# Altium schematic sheet УШЯИ.411618.029Э Э3 Лист 5.schdoc
size 420 x 297 mm; SheetNumber: 4; SheetTotal: 7
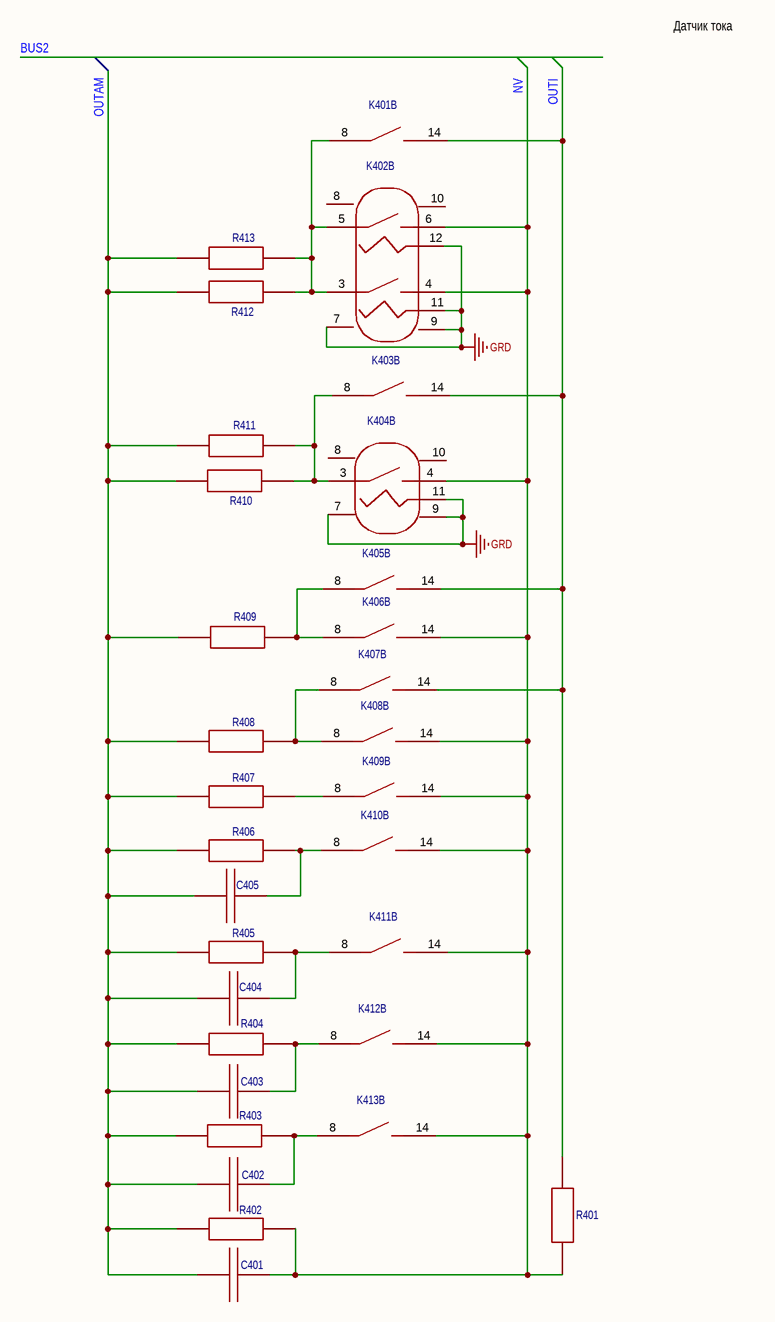
[diagram p0: УШЯИ.411618.029Э Э3 Лист 5.schdoc]

## Parts
C401  Конденсатор К10-17Б М47 33пФ NP0 5% [DIP]  [Конденсатор К10-17Б М47 X.X.xФ  NP0 5% [DIP 8мм]]  (value not drawn)
C402  Конденсатор К10-17Б М47 33пФ NP0 5% [DIP]  [Конденсатор К10-17Б М47 X.X.xФ  NP0 5% [DIP 5мм]]  (value not drawn)
C403  Конденсатор К10-17Б М47 33пФ NP0 5% [DIP]  [Конденсатор К10-17Б М47 X.X.xФ  NP0 5% [DIP 5мм]]  (value not drawn)
C404  Конденсатор К10-17Б М47 33пФ NP0 5% [DIP]  [Конденсатор К10-17Б М47 X.X.xФ  NP0 5% [DIP 5мм]]  (value not drawn)
C405  Конденсатор К10-17Б М47 33пФ NP0 5% [DIP]  [Конденсатор К10-17Б М47 X.X.xФ  NP0 5% [DIP 5мм]]  (value not drawn)
K401  Реле герконовое DIP05-1A72-13L  [PCB]  [RELAY-TH_STANDEXMEDER_DIP05-1A72-13L]  (value not drawn)  (part B of 2)
K402  Реле герконовое УШЯИ.685442.092 (2 реле)  (value not drawn)  (part B of 2)
K403  Реле герконовое DIP05-1A72-13L  [PCB]  [RELAY-TH_STANDEXMEDER_DIP05-1A72-13L]  (value not drawn)  (part B of 2)
K404  Реле герконовое УШЯИ.685442.092 (1 реле)  (value not drawn)  (part B of 2)
K405  Реле герконовое DIP05-1A72-13L  [PCB]  [RELAY-TH_STANDEXMEDER_DIP05-1A72-13L]  (value not drawn)  (part B of 2)
K406  Реле герконовое DIP05-1A72-13L  [PCB]  [RELAY-TH_STANDEXMEDER_DIP05-1A72-13L]  (value not drawn)  (part B of 2)
K407  Реле герконовое DIP05-1A72-13L  [PCB]  [RELAY-TH_STANDEXMEDER_DIP05-1A72-13L]  (value not drawn)  (part B of 2)
K408  Реле герконовое DIP05-1A72-13L  [PCB]  [RELAY-TH_STANDEXMEDER_DIP05-1A72-13L]  (value not drawn)  (part B of 2)
K409  Реле герконовое DIP05-1A72-13L  [PCB]  [RELAY-TH_STANDEXMEDER_DIP05-1A72-13L]  (value not drawn)  (part B of 2)
K410  Реле герконовое DIP05-1A72-13L  [PCB]  [RELAY-TH_STANDEXMEDER_DIP05-1A72-13L]  (value not drawn)  (part B of 2)
K411  Реле герконовое DIP05-1A72-13L  [PCB]  [RELAY-TH_STANDEXMEDER_DIP05-1A72-13L]  (value not drawn)  (part B of 2)
K412  Реле герконовое DIP05-1A72-13L  [PCB]  [RELAY-TH_STANDEXMEDER_DIP05-1A72-13L]  (value not drawn)  (part B of 2)
K413  Реле герконовое DIP05-1A72-13L  [PCB]  [RELAY-TH_STANDEXMEDER_DIP05-1A72-13L]  (value not drawn)  (part B of 2)
R401  Резистор C2-29В-0,25  24кОм ±0,5% [DIP]  (value not drawn)
R402  Резистор SM204031006FE 100МОм ±1%[DIP]  [RES-TH_L27.4-W2.5-P22.86-D0.8]  (value not drawn)
R403  Резистор RK1/4DCT52R1105F 11 МОм ±1% [DIP]  (value not drawn)
R404  Резистор C2-29В-0,25 1 МОм ±0,5% [DIP]  (value not drawn)
R405  Резистор C2-29В-0,25 100 кОм ±0,5% [DIP]  (value not drawn)
R406  Резистор C2-29B-1 10 кОм ±0,5% [DIP]  (value not drawn)
R407  Резистор C2-29B-1 1 кОм ±0,5% [DIP]  (value not drawn)
R408  Резистор C2-29B-1 100 Ом ±0,5% [DIP]  (value not drawn)
R409  Резистор C2-29B-2 10 Ом ±0,5% [DIP]  (value not drawn)
R410  Резистор MP930-2.00-1% [TO-220-2]  [TO-220-2_L10.4-W3.2-P5.08-L]  (value not drawn)
R411  Резистор MP930-2.00-1% [TO-220-2]  [TO-220-2_L10.4-W3.2-P5.08-L]  (value not drawn)
R412  Резистор MP930-0.20-1% [TO-220-2]  [TO-220-2_L10.4-W3.2-P5.08-L]  (value not drawn)
R413  Резистор MP930-0.20-1% [TO-220-2]  [TO-220-2_L10.4-W3.2-P5.08-L]  (value not drawn)

## Nets
GRD: K402.7 K402.9 K402.11 K402.12 K404.7 K404.9 K404.11
NV: C401.1 K402.4 K402.6 K404.4 K406.14 K408.14 K409.14 K410.14 K411.14 K412.14 K413.14 R401.1 R402.1
OUTAM: C401.2 C402.2 C403.2 C404.2 C405.2 R402.2 R403.2 R404.2 R405.2 R406.2 R407.2 R408.2 R409.2 R410.2 R411.2 R412.2 R413.2
OUTI: K401.14 K403.14 K405.14 K407.14 R401.2
NetC402_1: C402.1 K413.8 R403.1
NetC403_1: C403.1 K412.8 R404.1
NetC404_1: C404.1 K411.8 R405.1
NetC405_1: C405.1 K410.8 R406.1
NetK401_8: K401.8 K402.3 K402.5 R412.1 R413.1
NetK403_8: K403.8 K404.3 R410.1 R411.1
NetK405_8: K405.8 K406.8 R409.1
NetK407_8: K407.8 K408.8 R408.1
NetK409_8: K409.8 R407.1

Not connected (* = marked no-connect by the designer): K402 8 10; K404 8 10

## Buses and harness runs
bus BUS2

## Notes on the sheet
- Датчик тока
- Подп. и дата
- Инв.№ дубл.
- Взам.инв.№
- Подп.и дата
- Инв.№ подл.
- Изм.
- Лист
- № докум.
- Подп.
- Дата
- Формат  A3

## Library data of the parts
C401 = Конденсатор К10-17Б М47 33пФ NP0 5% [DIP]: Contributor: jordanjin; Convert to PCB: yes; UniqueId: ggeb2980edeb3a9b297; Origin Footprint: К10-17Б М47; Device: Конденсатор К10-17Б М47 33пФ NP0 5% [DIP]; Symbol: Конденсатор К10-17Б М47 33пФ NP0 5% [DIP]; Manufacturer Part: К10-17Б М47; Add into BOM: yes; spicePre: C; spiceSymbolName: Конденсатор К10-17Б М47 33пФ NP0 5% [DIP]
C402 = Конденсатор К10-17Б М47 33пФ NP0 5% [DIP]: Contributor: jordanjin; Convert to PCB: yes; UniqueId: gge1afb12a00f1bc7d3; Origin Footprint: К10-17Б М47; Device: Конденсатор К10-17Б М47 33пФ NP0 5% [DIP]; Symbol: Конденсатор К10-17Б М47 33пФ NP0 5% [DIP]; Manufacturer Part: К10-17Б М47; Add into BOM: yes; spicePre: C; spiceSymbolName: Конденсатор К10-17Б М47 33пФ NP0 5% [DIP]
C403 = Конденсатор К10-17Б М47 33пФ NP0 5% [DIP]: Contributor: jordanjin; Convert to PCB: yes; UniqueId: gge58857190431db6b6; Origin Footprint: К10-17Б М47; Device: Конденсатор К10-17Б М47 33пФ NP0 5% [DIP]; Symbol: Конденсатор К10-17Б М47 33пФ NP0 5% [DIP]; Manufacturer Part: К10-17Б М47; Add into BOM: yes; spicePre: C; spiceSymbolName: Конденсатор К10-17Б М47 33пФ NP0 5% [DIP]
C404 C405 = Конденсатор К10-17Б М47 33пФ NP0 5% [DIP]: Contributor: jordanjin; Convert to PCB: yes; UniqueId: gge5cad80b88e7cf07d; Origin Footprint: К10-17Б М47; Device: Конденсатор К10-17Б М47 33пФ NP0 5% [DIP]; Symbol: Конденсатор К10-17Б М47 33пФ NP0 5% [DIP]; Manufacturer Part: К10-17Б М47; Add into BOM: yes; spicePre: C; spiceSymbolName: Конденсатор К10-17Б М47 33пФ NP0 5% [DIP]
K401 = Реле герконовое DIP05-1A72-13L  [PCB]: Manufacturer: STANDEXMEDER; subpart_no: 1; Contributor: jordanjin; Convert to PCB: yes; UniqueId: gge7703f0eace438da9; Origin Footprint: RELAY-TH_STANDEXMEDER_DIP05-1A72-13L; Device: Реле герконовое DIP05-1A72-13L  [PCB]; Symbol: Реле герконовое DIP05-1A72-13L  [PCB]; Supplier: LCSC; Supplier Part: C1524853; Manufacturer Part: DIP05-1A72-13L; JLCPCB Part Class: Extended Part; spicePre: K; spiceSymbolName: Реле герконовое DIP05-1A72-13L  [PCB]; Add into BOM: yes; FootprintName: RELAY-TH_STANDEXMEDER_DIP05-1A72-13L
K402 = Реле герконовое УШЯИ.685442.092 (2 реле): Manufacturer: ОАО"МНИПИ"; Part Number: 1; Origin Footprint: УШЯИ.685442.092 В2; Contributor: jordanjin; Convert to PCB: yes; UniqueId: gge1247e5c314fd5f25; Device: Реле герконовое УШЯИ.685442.092 (2 реле); Symbol: Реле герконовое УШЯИ.685442.092 (2 реле); Supplier: LCSC; Manufacturer Part: УШЯИ.685442.092; Subpart_no: 1; Add into BOM: yes; spicePre: K; spiceSymbolName: Реле герконовое УШЯИ.685442.092 (2 реле)
K403 = Реле герконовое DIP05-1A72-13L  [PCB]: Manufacturer: STANDEXMEDER; subpart_no: 1; Contributor: jordanjin; Convert to PCB: yes; UniqueId: ggecfce9d1afd95e29a; Origin Footprint: RELAY-TH_STANDEXMEDER_DIP05-1A72-13L; Device: Реле герконовое DIP05-1A72-13L  [PCB]; Symbol: Реле герконовое DIP05-1A72-13L  [PCB]; Supplier: LCSC; Supplier Part: C1524853; Manufacturer Part: DIP05-1A72-13L; JLCPCB Part Class: Extended Part; spicePre: K; spiceSymbolName: Реле герконовое DIP05-1A72-13L  [PCB]; Add into BOM: yes; FootprintName: RELAY-TH_STANDEXMEDER_DIP05-1A72-13L
K404 = Реле герконовое УШЯИ.685442.092 (1 реле): Manufacturer: ОАО"МНИПИ"; subpart_no: 1; Contributor: jordanjin; Convert to PCB: yes; UniqueId: gge4bca94a3251bd602; Origin Footprint: УШЯИ.685442.092; Device: Реле герконовое УШЯИ.685442.092 (1 реле); Symbol: Реле герконовое УШЯИ.685442.092 (1 реле); Supplier: LCSC; Manufacturer Part: УШЯИ.685442.092; JLCPCB Part Class: Extended Part; spicePre: K; spiceSymbolName: Реле герконовое УШЯИ.685442.092 (1 реле); Add into BOM: yes
K405 = Реле герконовое DIP05-1A72-13L  [PCB]: Manufacturer: STANDEXMEDER; subpart_no: 1; Contributor: jordanjin; Convert to PCB: yes; UniqueId: gge6582920def2a9cac; Origin Footprint: RELAY-TH_STANDEXMEDER_DIP05-1A72-13L; Device: Реле герконовое DIP05-1A72-13L  [PCB]; Symbol: Реле герконовое DIP05-1A72-13L  [PCB]; Supplier: LCSC; Supplier Part: C1524853; Manufacturer Part: DIP05-1A72-13L; JLCPCB Part Class: Extended Part; spicePre: K; spiceSymbolName: Реле герконовое DIP05-1A72-13L  [PCB]; Add into BOM: yes; FootprintName: RELAY-TH_STANDEXMEDER_DIP05-1A72-13L
K406 = Реле герконовое DIP05-1A72-13L  [PCB]: Manufacturer: STANDEXMEDER; subpart_no: 1; Contributor: jordanjin; Convert to PCB: yes; UniqueId: gge44bfcf777da063ff; Origin Footprint: RELAY-TH_STANDEXMEDER_DIP05-1A72-13L; Device: Реле герконовое DIP05-1A72-13L  [PCB]; Symbol: Реле герконовое DIP05-1A72-13L  [PCB]; Supplier: LCSC; Supplier Part: C1524853; Manufacturer Part: DIP05-1A72-13L; JLCPCB Part Class: Extended Part; spicePre: K; spiceSymbolName: Реле герконовое DIP05-1A72-13L  [PCB]; Add into BOM: yes; FootprintName: RELAY-TH_STANDEXMEDER_DIP05-1A72-13L
K407 = Реле герконовое DIP05-1A72-13L  [PCB]: Manufacturer: STANDEXMEDER; subpart_no: 1; Contributor: jordanjin; Convert to PCB: yes; UniqueId: gge83a96914b1356f5b; Origin Footprint: RELAY-TH_STANDEXMEDER_DIP05-1A72-13L; Device: Реле герконовое DIP05-1A72-13L  [PCB]; Symbol: Реле герконовое DIP05-1A72-13L  [PCB]; Supplier: LCSC; Supplier Part: C1524853; Manufacturer Part: DIP05-1A72-13L; JLCPCB Part Class: Extended Part; spicePre: K; spiceSymbolName: Реле герконовое DIP05-1A72-13L  [PCB]; Add into BOM: yes; FootprintName: RELAY-TH_STANDEXMEDER_DIP05-1A72-13L
K408 = Реле герконовое DIP05-1A72-13L  [PCB]: Manufacturer: STANDEXMEDER; subpart_no: 1; Contributor: jordanjin; Convert to PCB: yes; UniqueId: gge25a55c81e8cc81bc; Origin Footprint: RELAY-TH_STANDEXMEDER_DIP05-1A72-13L; Device: Реле герконовое DIP05-1A72-13L  [PCB]; Symbol: Реле герконовое DIP05-1A72-13L  [PCB]; Supplier: LCSC; Supplier Part: C1524853; Manufacturer Part: DIP05-1A72-13L; JLCPCB Part Class: Extended Part; spicePre: K; spiceSymbolName: Реле герконовое DIP05-1A72-13L  [PCB]; Add into BOM: yes; FootprintName: RELAY-TH_STANDEXMEDER_DIP05-1A72-13L
K409 = Реле герконовое DIP05-1A72-13L  [PCB]: Manufacturer: STANDEXMEDER; subpart_no: 1; Contributor: jordanjin; Convert to PCB: yes; UniqueId: gge6e1296d6b40714de; Origin Footprint: RELAY-TH_STANDEXMEDER_DIP05-1A72-13L; Device: Реле герконовое DIP05-1A72-13L  [PCB]; Symbol: Реле герконовое DIP05-1A72-13L  [PCB]; Supplier: LCSC; Supplier Part: C1524853; Manufacturer Part: DIP05-1A72-13L; JLCPCB Part Class: Extended Part; spicePre: K; spiceSymbolName: Реле герконовое DIP05-1A72-13L  [PCB]; Add into BOM: yes; FootprintName: RELAY-TH_STANDEXMEDER_DIP05-1A72-13L
K410 = Реле герконовое DIP05-1A72-13L  [PCB]: Manufacturer: STANDEXMEDER; subpart_no: 1; Contributor: jordanjin; Convert to PCB: yes; UniqueId: ggece3a82d518531f55; Origin Footprint: RELAY-TH_STANDEXMEDER_DIP05-1A72-13L; Device: Реле герконовое DIP05-1A72-13L  [PCB]; Symbol: Реле герконовое DIP05-1A72-13L  [PCB]; Supplier: LCSC; Supplier Part: C1524853; Manufacturer Part: DIP05-1A72-13L; JLCPCB Part Class: Extended Part; spicePre: K; spiceSymbolName: Реле герконовое DIP05-1A72-13L  [PCB]; Add into BOM: yes; FootprintName: RELAY-TH_STANDEXMEDER_DIP05-1A72-13L
K411 = Реле герконовое DIP05-1A72-13L  [PCB]: Manufacturer: STANDEXMEDER; subpart_no: 1; Contributor: jordanjin; Convert to PCB: yes; UniqueId: gge32df1270bb8c8d2c; Origin Footprint: RELAY-TH_STANDEXMEDER_DIP05-1A72-13L; Device: Реле герконовое DIP05-1A72-13L  [PCB]; Symbol: Реле герконовое DIP05-1A72-13L  [PCB]; Supplier: LCSC; Supplier Part: C1524853; Manufacturer Part: DIP05-1A72-13L; JLCPCB Part Class: Extended Part; spicePre: K; spiceSymbolName: Реле герконовое DIP05-1A72-13L  [PCB]; Add into BOM: yes; FootprintName: RELAY-TH_STANDEXMEDER_DIP05-1A72-13L
K412 = Реле герконовое DIP05-1A72-13L  [PCB]: Manufacturer: STANDEXMEDER; subpart_no: 1; Contributor: jordanjin; Convert to PCB: yes; UniqueId: gge25a4072e4ef30527; Origin Footprint: RELAY-TH_STANDEXMEDER_DIP05-1A72-13L; Device: Реле герконовое DIP05-1A72-13L  [PCB]; Symbol: Реле герконовое DIP05-1A72-13L  [PCB]; Supplier: LCSC; Supplier Part: C1524853; Manufacturer Part: DIP05-1A72-13L; JLCPCB Part Class: Extended Part; spicePre: K; spiceSymbolName: Реле герконовое DIP05-1A72-13L  [PCB]; Add into BOM: yes; FootprintName: RELAY-TH_STANDEXMEDER_DIP05-1A72-13L
K413 = Реле герконовое DIP05-1A72-13L  [PCB]: Manufacturer: STANDEXMEDER; subpart_no: 1; Contributor: jordanjin; Convert to PCB: yes; UniqueId: ggef3d88c0f6f02bbb0; Origin Footprint: RELAY-TH_STANDEXMEDER_DIP05-1A72-13L; Device: Реле герконовое DIP05-1A72-13L  [PCB]; Symbol: Реле герконовое DIP05-1A72-13L  [PCB]; Supplier: LCSC; Supplier Part: C1524853; Manufacturer Part: DIP05-1A72-13L; JLCPCB Part Class: Extended Part; spicePre: K; spiceSymbolName: Реле герконовое DIP05-1A72-13L  [PCB]; Add into BOM: yes; FootprintName: RELAY-TH_STANDEXMEDER_DIP05-1A72-13L
R401 = Резистор C2-29В-0,25  24кОм ±0,5% [DIP]: Contributor: jordanjin; Convert to PCB: yes; UniqueId: gge0309ee4b015114c0; Origin Footprint: C2-29В-0,25; Device: Резистор C2-29В-0,25  24кОм ±0,5% [DIP]; Symbol: Резистор C2-29В-0,25  24кОм ±0,5% [DIP]; Manufacturer Part: C2-29В-0,25; spicePre: R; spiceSymbolName: Резистор C2-29В-0,25 1 МОм ±0,5% [DIP]; Add into BOM: yes
R402 = Резистор SM204031006FE 100МОм ±1%[DIP]: Manufacturer: Ohmite; Contributor: jordanjin; Convert to PCB: yes; UniqueId: gge398e542ec90bf08a; ModelId: 5898483a0a144dd58ae137ef3515169e; Origin Footprint: RES-TH_L27.4-W2.5-P22.86-D0.8; Device: Резистор SM204031006FE 100МОм ±1%[DIP]; Symbol: Резистор SM204031006FE 100МОм ±1%[DIP]; Supplier: LCSC; Manufacturer Part: SM204031006FE; JLCPCB Part Class: Extended Part; spicePre: R; spiceSymbolName: Резистор SM204031006FE 100МОм ±1%[DIP]; Add into BOM: yes; FootprintName: RES-TH_L27.4-W2.5-P22.86-D0.8; ModelName: RES-TH_L27.4-W2.5-P22.86-D0.8
R403 = Резистор RK1/4DCT52R1105F 11 МОм ±1% [DIP]: Manufacturer: KOA Speer Electronics; Contributor: jordanjin; Convert to PCB: yes; UniqueId: gge17af7a16159332f4; Origin Footprint: RK1/4DCT52R1105F; Device: Резистор RK1/4DCT52R1105F 11 МОм ±1% [DIP]; Symbol: Резистор RK1/4DCT52R1105F 11 МОм ±1% [DIP]; Supplier: LCSC; Manufacturer Part: RK1/4DCT52R1105F; JLCPCB Part Class: Extended Part; spicePre: R; spiceSymbolName: Резистор RK1/4DCT52R1105F 11 МОм ±1% [DIP]; Add into BOM: yes
R404 = Резистор C2-29В-0,25 1 МОм ±0,5% [DIP]: Contributor: jordanjin; Convert to PCB: yes; UniqueId: gge597395f2396ee8d0; Origin Footprint: C2-29В-0,25; Device: Резистор C2-29В-0,25 1 МОм ±0,5% [DIP]; Symbol: Резистор C2-29В-0,25 1 МОм ±0,5% [DIP]; Manufacturer Part: C2-29В-0,25; spicePre: R; spiceSymbolName: Резистор C2-29В-0,25 1 МОм ±0,5% [DIP]; Add into BOM: yes
R405 = Резистор C2-29В-0,25 100 кОм ±0,5% [DIP]: Contributor: jordanjin; Convert to PCB: yes; UniqueId: gge822403ea663bc24b; Origin Footprint: C2-29В-0,25; Device: Резистор C2-29В-0,25 100 кОм ±0,5% [DIP]; Symbol: Резистор C2-29В-0,25 100 кОм ±0,5% [DIP]; Manufacturer Part: C2-29В-0,25; spicePre: R; spiceSymbolName: Резистор C2-29В-0,25 1 МОм ±0,5% [DIP]; Add into BOM: yes
R406 = Резистор C2-29B-1 10 кОм ±0,5% [DIP]: Origin Footprint: C2-29В-1; Contributor: jordanjin; Convert to PCB: yes; UniqueId: ggec17474f26dc62fd1; Device: Резистор C2-29B-1 10 кОм ±0,5% [DIP]; Symbol: Резистор C2-29B-1 10 кОм ±0,5% [DIP]; Manufacturer Part: C2-29В-1; spicePre: R; spiceSymbolName: Резистор C2-29B-1 1 кОм ±0,5% [DIP]; Add into BOM: yes
R407 = Резистор C2-29B-1 1 кОм ±0,5% [DIP]: Origin Footprint: C2-29В-1; Contributor: jordanjin; Convert to PCB: yes; UniqueId: ggede1ad387817843c7; Device: Резистор C2-29B-1 1 кОм ±0,5% [DIP]; Symbol: Резистор C2-29B-1 1 кОм ±0,5% [DIP]; Manufacturer Part: C2-29В-1; spicePre: R; spiceSymbolName: Резистор C2-29B-1 1 кОм ±0,5% [DIP]; Add into BOM: yes
R408 = Резистор C2-29B-1 100 Ом ±0,5% [DIP]: Origin Footprint: C2-29В-1; Contributor: jordanjin; Convert to PCB: yes; UniqueId: ggeda711d1dd3061336; Device: Резистор C2-29B-1 100 Ом ±0,5% [DIP]; Symbol: Резистор C2-29B-1 100 Ом ±0,5% [DIP]; Manufacturer Part: C2-29В-1; spicePre: R; spiceSymbolName: Резистор C2-29B-1 1 кОм ±0,5% [DIP]; Add into BOM: yes
R409 = Резистор C2-29B-2 10 Ом ±0,5% [DIP]: Origin Footprint: C2-29В-2; Contributor: jordanjin; Convert to PCB: yes; UniqueId: gge78c152a58996e232; Device: Резистор C2-29B-2 10 Ом ±0,5% [DIP]; Symbol: Резистор C2-29B-2 10 Ом ±0,5% [DIP]; Manufacturer Part: C2-29В-2; spicePre: R; spiceSymbolName: Резистор C2-29B-2 10 Ом ±0,5% [DIP]; Add into BOM: yes
R410 = Резистор MP930-2.00-1% [TO-220-2]: Manufacturer: Caddock; Contributor: jordanjin; nameAlias: Value; Convert to PCB: yes; UniqueId: gge2a6eb6e1ae5f6d3e; ModelId: 670c0f0e5b9b4d3a964f1f27b9ac0995; Origin Footprint: TO-220-2_L10.4-W3.2-P5.08-L; Device: Резистор MP930-2.00-1% [TO-220-2]; Symbol: Резистор MP930-2.00-1% [TO-220-2]; Supplier: LCSC; Manufacturer Part: MP930-2.00-1%; JLCPCB Part Class: Extended Part; spicePre: R; spiceSymbolName: Резистор  MP930-2.00-1% [TO-220-2]; Add into BOM: yes; FootprintName: TO-220-2_L10.4-W3.2-P5.08-L; ModelName: TO-220-2_L10.4-W3.2-P5.08-L
R411 = Резистор MP930-2.00-1% [TO-220-2]: Manufacturer: Caddock; Contributor: jordanjin; nameAlias: Value; Convert to PCB: yes; UniqueId: gge08c3d0ad6155f0e6; ModelId: 670c0f0e5b9b4d3a964f1f27b9ac0995; Origin Footprint: TO-220-2_L10.4-W3.2-P5.08-L; Device: Резистор MP930-2.00-1% [TO-220-2]; Symbol: Резистор MP930-2.00-1% [TO-220-2]; Supplier: LCSC; Manufacturer Part: MP930-2.00-1%; JLCPCB Part Class: Extended Part; spicePre: R; spiceSymbolName: Резистор  MP930-2.00-1% [TO-220-2]; Add into BOM: yes; FootprintName: TO-220-2_L10.4-W3.2-P5.08-L; ModelName: TO-220-2_L10.4-W3.2-P5.08-L
R412 = Резистор MP930-0.20-1% [TO-220-2]: Manufacturer: Caddock; Manufacturer Part: MP930-2.00-1%; Contributor: jordanjin; nameAlias: Value; Convert to PCB: yes; UniqueId: ggea90ba94bd7a82930; ModelId: 670c0f0e5b9b4d3a964f1f27b9ac0995; Origin Footprint: TO-220-2_L10.4-W3.2-P5.08-L; Device: Резистор MP930-0.20-1% [TO-220-2]; Symbol: Резистор MP930-0.20-1% [TO-220-2]; Supplier: LCSC; JLCPCB Part Class: Extended Part; spicePre: R; spiceSymbolName: Резистор  MP930-2.00-1% [TO-220-2]; Add into BOM: yes; FootprintName: TO-220-2_L10.4-W3.2-P5.08-L; ModelName: TO-220-2_L10.4-W3.2-P5.08-L
R413 = Резистор MP930-0.20-1% [TO-220-2]: Manufacturer: Caddock; Manufacturer Part: MP930-2.00-1%; Contributor: jordanjin; nameAlias: Value; Convert to PCB: yes; UniqueId: ggefed5bbbb154e7d74; ModelId: 670c0f0e5b9b4d3a964f1f27b9ac0995; Origin Footprint: TO-220-2_L10.4-W3.2-P5.08-L; Device: Резистор MP930-0.20-1% [TO-220-2]; Symbol: Резистор MP930-0.20-1% [TO-220-2]; Supplier: LCSC; JLCPCB Part Class: Extended Part; spicePre: R; spiceSymbolName: Резистор  MP930-2.00-1% [TO-220-2]; Add into BOM: yes; FootprintName: TO-220-2_L10.4-W3.2-P5.08-L; ModelName: TO-220-2_L10.4-W3.2-P5.08-L